# Altium schematic sheet ESP8266.SchDoc
size 381 x 241 mm
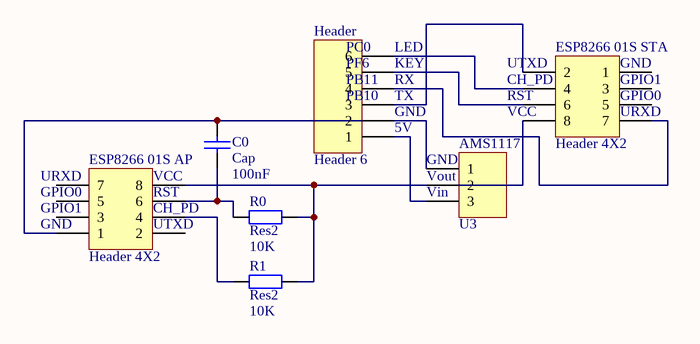
[diagram p0: ESP8266.SchDoc]

## Parts
AMS1117  U3  [HDR1X3]
C0  Cap  value 100nF  [RAD-0.3]
ESP8266_01S_AP  Header 4X2  [HDR2X4]
ESP8266_01S_STA  Header 4X2  [HDR2X4]
Header  Header 6  [HDR1X6]
R0  Res2  value 10K  [AXIAL-0.4]
R1  Res2  value 10K  [AXIAL-0.4]

## Nets
NetAMS1117_1: AMS1117.1 Header.2
NetAMS1117_2: AMS1117.2 ESP8266_01S_AP.8 R0.2 R1.2
NetAMS1117_3: AMS1117.3 Header.1
NetC0_1: C0.1 ESP8266_01S_AP.6 R0.1
NetC0_2: C0.2 ESP8266_01S_AP.1
NetESP8266_01S_AP_4: ESP8266_01S_AP.4 R1.1
NetESP8266_01S_STA_2: ESP8266_01S_STA.2 Header.3
NetESP8266_01S_STA_4: ESP8266_01S_STA.4 Header.6
NetESP8266_01S_STA_6: ESP8266_01S_STA.6 Header.5
NetESP8266_01S_STA_7: ESP8266_01S_STA.7 Header.4

Not connected (* = marked no-connect by the designer): ESP8266_01S_AP 2 3 5 7; ESP8266_01S_STA 1 3 5 8

## Notes on the sheet
- (near Header) PB10
- (near Header) PB11
- (near Header) PF6
- (near Header) PC0
- (near Header) TX
- (near Header) RX
- (near Header) KEY
- (near Header) LED
- (near ESP8266_01S_STA) UTXD
- (near ESP8266_01S_STA) CH_PD
- (near ESP8266_01S_STA) RST
- (near ESP8266_01S_STA) GND
- (near ESP8266_01S_STA) GPIO1
- (near ESP8266_01S_STA) GPIO0
- (near ESP8266_01S_AP) URXD
- (near ESP8266_01S_AP) VCC
- (near Header) 5V
- (near Header) GND
- (near AMS1117) GND
- (near AMS1117) Vout
- (near ESP8266_01S_STA) VCC
- (near ESP8266_01S_STA) URXD
- (near ESP8266_01S_AP) GND
- (near ESP8266_01S_AP) GPIO1
- (near ESP8266_01S_AP) GPIO0
- (near ESP8266_01S_AP) UTXD
- (near ESP8266_01S_AP) CH_PD
- (near ESP8266_01S_AP) RST
- (near AMS1117) Vin

## Library data of the parts
AMS1117 = Header 3: Header, 3-Pin; LatestRevisionDate: 17-Jul-2002; LatestRevisionNote: Re-released for DXP Platform.; Publisher: Altium Limited
C0 = Cap: Capacitor; Published: 8-Jun-2000; LatestRevisionDate: 17-Jul-2002; LatestRevisionNote: Re-released for DXP Platform.; PackageReference: RAD-0.3; Publisher: Altium Limited; PackageDescription: Radial Cap, Thru-Hole; 2 Leads; 0.3 in Pin Spacing
ESP8266_01S_AP ESP8266_01S_STA = Header 4X2: Header, 4-Pin, Dual row; LatestRevisionDate: 17-Jul-2002; LatestRevisionNote: Re-released for DXP Platform.; Publisher: Altium Limited
Header = Header 6: Header, 6-Pin; LatestRevisionDate: 17-Jul-2002; LatestRevisionNote: Re-released for DXP Platform.; Publisher: Altium Limited
R0 R1 = Res2: Resistor; Published: 8-Jun-2000; LatestRevisionDate: 17-Jul-2002; LatestRevisionNote: Re-released for DXP Platform.; PackageReference: AXIAL-0.4; Publisher: Altium Limited; PackageDescription: Axial Device, Thru-Hole; 2 Leads; 0.4 in Pin Spacing